# Altium project ConditioningV3.PrjPcb (part 2 of 3)

## Sheet Power_MCU.SchDoc
size 381 x 279 mm; Organization: SACO Technologies; Address1: 7806, Trans-Canada Hwy; Address2: Montreal, QC, Canada - H4S1L3.; Address3: H4S1L3; SheetNumber: 3; SheetTotal: 6; ELE682ProjectName: Conditioning & TLL PCB; ProjectRevision: C; SchDesignedBy1: Alexis Gagnon; SchDesignedBy2: Megane Cyr
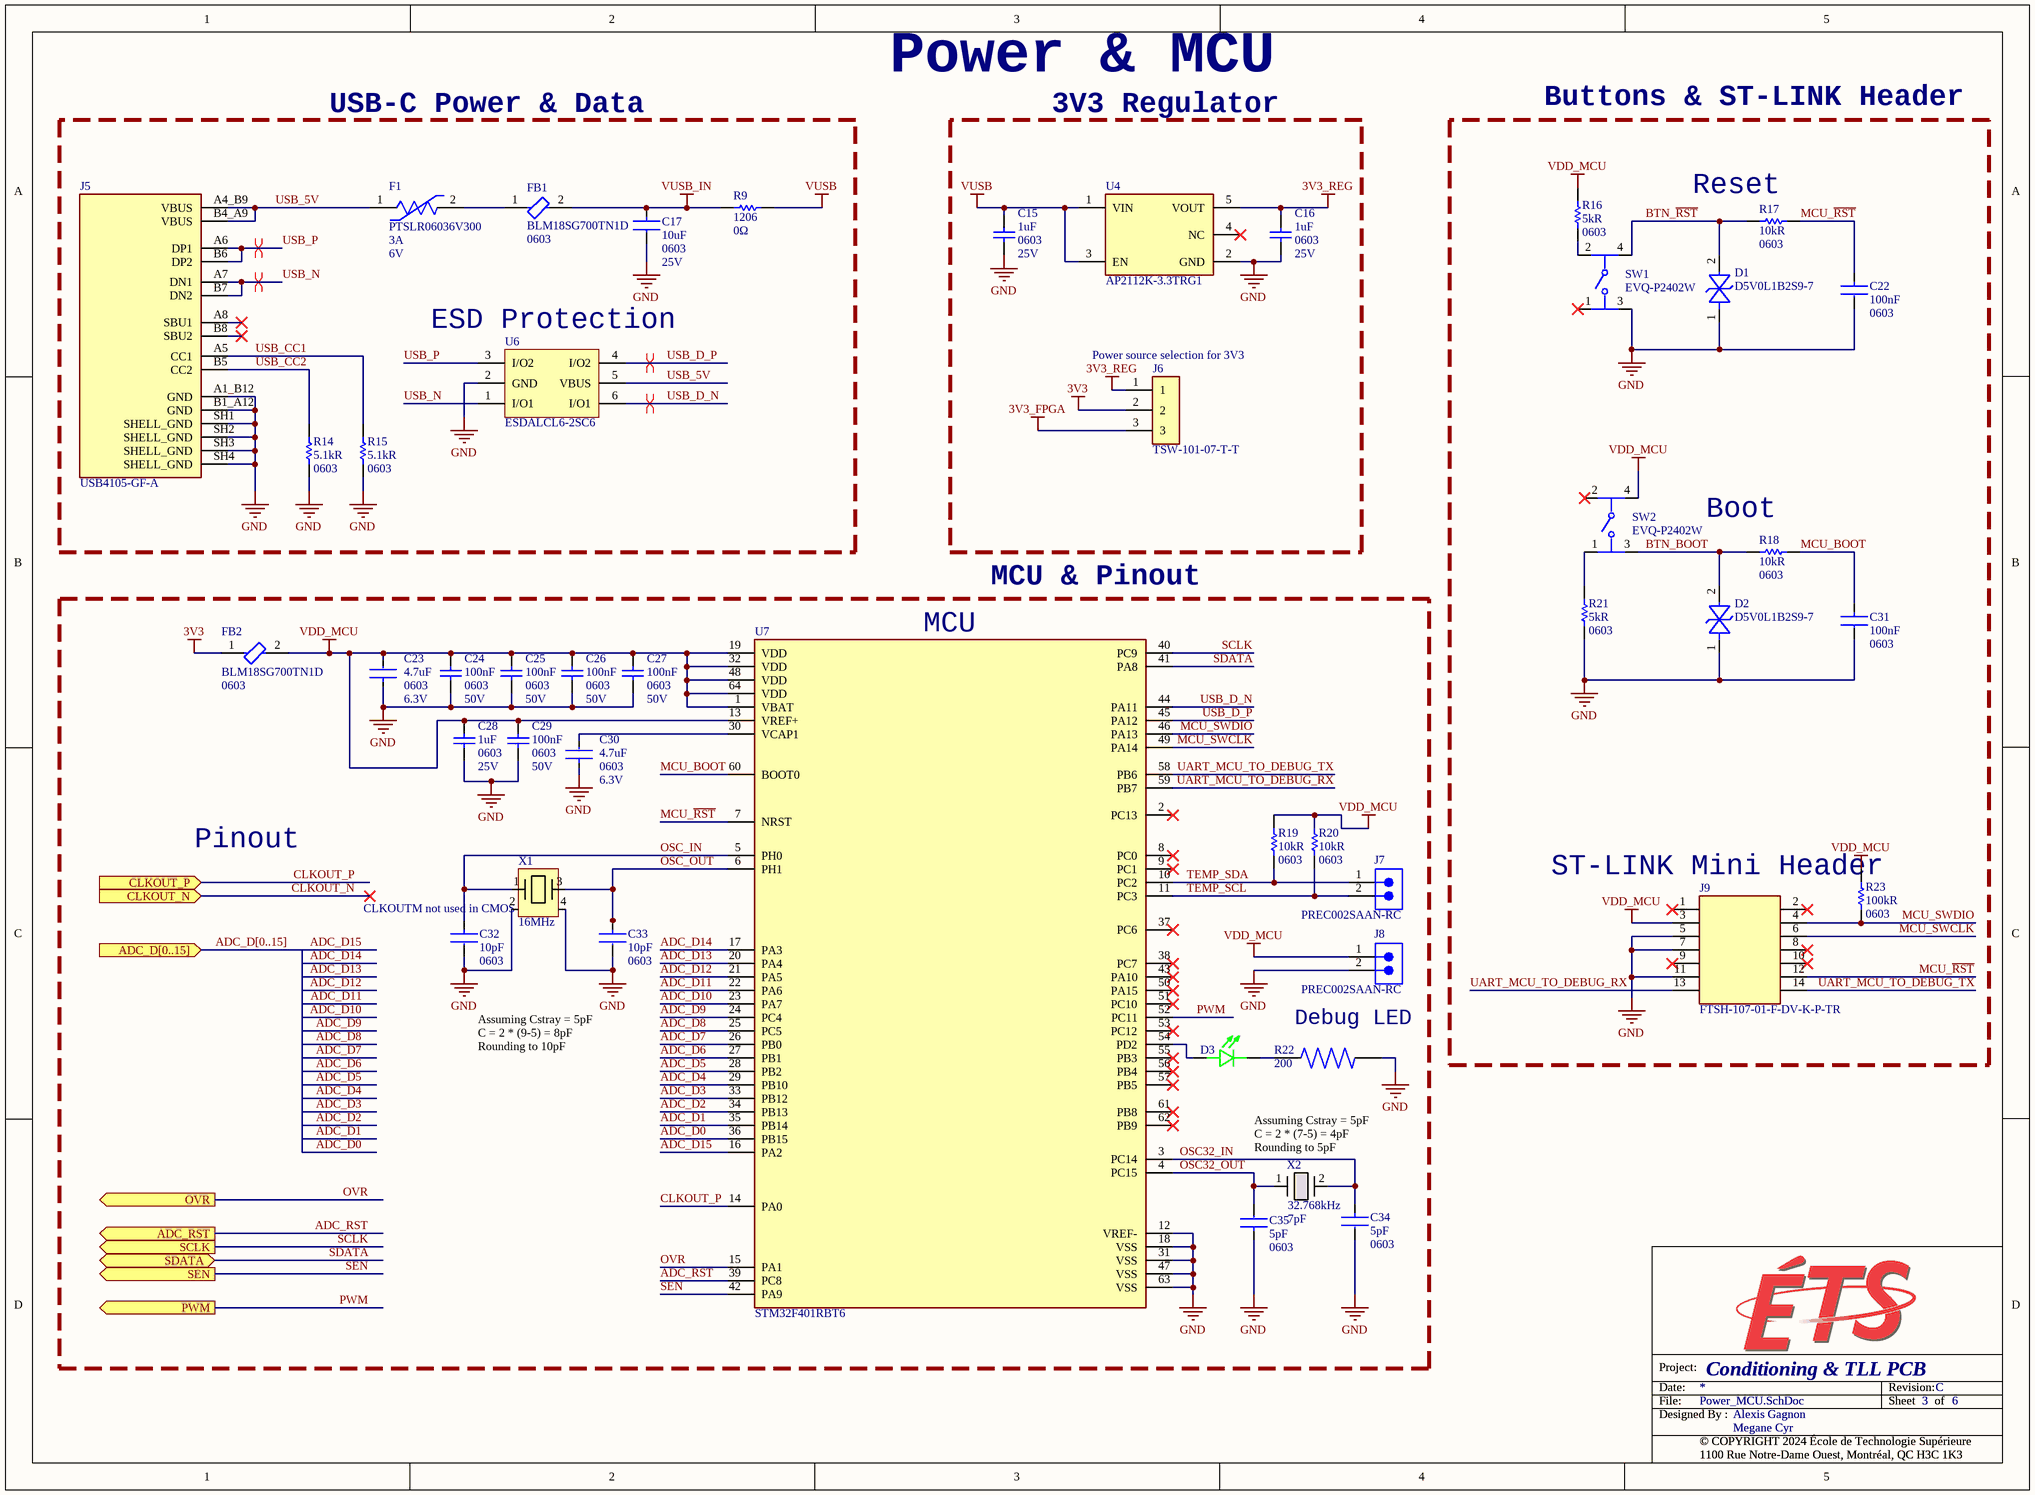
[diagram p4: Power_MCU.SchDoc]

### Parts
C15  value 1uF  Case/Package: 0603  Rated DC Voltage (URdc): 25V  [ANTC1608X90N]  (hidden comment: CL10A105KA8NNNC)
C16  value 1uF  Case/Package: 0603  Rated DC Voltage (URdc): 25V  [ANTC1608X90N]  (hidden comment: CL10A105KA8NNNC)
C17  value 10uF  Case/Package: 0603  Voltage: 25V  [C0603]  (hidden comment: GRM188R61E106MA73D)
C22  value 100nF  Case: 0603  [C0603-V2]  (hidden comment: CL10E104KC8VPNC)
C23  value 4.7uF  Package: 0603  Voltage Rating: 6.3V  [FP-C0603-CG-IPC_B]  (hidden comment: C0603C475K9PACTU)
C24  value 100nF  Case/Package: 0603  Voltage Rating: 50V  [ANTC1608X90N]  (hidden comment: CL10B104KB8NNWC)
C25  value 100nF  Case/Package: 0603  Voltage Rating: 50V  [ANTC1608X90N]  (hidden comment: CL10B104KB8NNWC)
C26  value 100nF  Case/Package: 0603  Voltage Rating: 50V  [ANTC1608X90N]  (hidden comment: CL10B104KB8NNWC)
C27  value 100nF  Case/Package: 0603  Voltage Rating: 50V  [ANTC1608X90N]  (hidden comment: CL10B104KB8NNWC)
C28  value 1uF  Case/Package: 0603  Rated DC Voltage (URdc): 25V  [ANTC1608X90N]  (hidden comment: CL10A105KA8NNNC)
C29  value 100nF  Case/Package: 0603  Voltage Rating: 50V  [ANTC1608X90N]  (hidden comment: CL10B104KB8NNWC)
C30  value 4.7uF  Package: 0603  Voltage Rating: 6.3V  [FP-C0603-CG-IPC_B]  (hidden comment: C0603C475K9PACTU)
C31  value 100nF  Case: 0603  [C0603-V2]  (hidden comment: CL10E104KC8VPNC)
C32  value 10pF  Case/Package: 0603  [C0603-V2]  (hidden comment: GCM1885C2A100JA16D)
C33  value 10pF  Case/Package: 0603  [C0603-V2]  (hidden comment: GCM1885C2A100JA16D)
C34  value 5pF  Case: 0603  [C0603-V2]  (hidden comment: 0603N5R0B101CT)
C35  value 5pF  Case: 0603  [C0603-V2]  (hidden comment: 0603N5R0B101CT)
D1  D5V0L1B2S9-7  [SOD923_DIO]
D2  D5V0L1B2S9-7  [SOD923_DIO]
D3  LTST-C170GKT  [LED_LTST-C170GKT_LTO]  (value not drawn)
F1  PTSLR06036V300  Current Hold: 3A  Voltage: 6V  [FP-PTSLR06036V300-MFG]
FB1  BLM18SG700TN1D  Case Code (Imperial): 0603  [BLM18SG700TN1D-MFG]
FB2  BLM18SG700TN1D  Case Code (Imperial): 0603  [BLM18SG700TN1D-MFG]
J5  USB4105-GF-A  [GCT_USB4105-GF-A]
J6  TSW-101-07-T-T  [SAMTEC_TSW-101-07-T-T]
J7  PREC002SAAN-RC  [CONN_PREC002SAAN-RC_SUL]
J8  PREC002SAAN-RC  [CONN_PREC002SAAN-RC_SUL]
J9  FTSH-107-01-F-DV-K-P-TR  [SAMTEC_FTSH-107-01-F-DV-K-P-TR]
R9  Case/Package: 1206  Resistance: 0Ω  [R1206]  (hidden comment: RC1206JR-070RL)
R14  value 5.1kR  Case/Package: 0603  [R0603]  (hidden comment: RC0603FR-075K1L)
R15  value 5.1kR  Case/Package: 0603  [R0603]  (hidden comment: RC0603FR-075K1L)
R16  value 5kR  Case: 0603  [R0603]  (hidden comment: RT0603BRE075KL)
R17  value 10kR  Case/Package: 0603  [R0603]  (hidden comment: RC0603FR-0710KL)
R18  value 10kR  Case/Package: 0603  [R0603]  (hidden comment: RC0603FR-0710KL)
R19  value 10kR  Case/Package: 0603  [R0603]  (hidden comment: RC0603FR-0710KL)
R20  value 10kR  Case/Package: 0603  [R0603]  (hidden comment: RC0603FR-0710KL)
R21  value 5kR  Case: 0603  [R0603]  (hidden comment: RT0603BRE075KL)
R22  value 200  [RESC1608X55N]  (hidden comment: RC0603JR-07200RL)
R23  value 100kR  Case/Package: 0603  [R0603]  (hidden comment: RC0603FR-07100KL)
SW1  EVQ-P2402W  [FP-EVQ-P2402W-MFG]
SW2  EVQ-P2402W  [FP-EVQ-P2402W-MFG]
U4  AP2112K-3.3TRG1  [FP-SOT25-MFG]
U6  ESDALCL6-2SC6  [ESDALCL6-2SC6]
U7  STM32F401RBT6  [QFP50P1200X1200X160-64N]
X1  value 16MHz  [FP-TSX-3225-MFG]  (hidden comment: TSX-3225 16.0000MF18X-AC0)
X2  value 32.768kHz  Load Capacitance: 7pF  [XTAL_SC32S-7PF20PPM_EPS]  (hidden comment: SC32S-7PF20PPM)

### Blocks framed on the sheet
3V3 Regulator: C15 C16 J6 U4

### Ports
ADC_D[0..15] (in, see TopLevel[3B], Connectors[3A], Heating[5B]), ADC_RST (out, see TopLevel[3B], Heating[5C]), CLKOUT_N (in, see TopLevel[3B], Heating[5B]), CLKOUT_P (in, see TopLevel[3B], Connectors[3B], Heating[5B]), OVR (out, see TopLevel[3B], Heating[5C]), PWM (out, see TopLevel[3B], Connectors[3B], Heating[2B]), SCLK (out, see TopLevel[3B], Heating[5C]), SDATA (bidir, see TopLevel[3B], Heating[5C]), SEN (out, see TopLevel[3B], Heating[5C])

### Nets
3V3: FB2.1 J6.2
3V3_FPGA: J6.3
3V3_REG: C16.2 J6.1 U4.5(VOUT)
GND: C15.1 C16.1 C17.2 C22.2 C23.1 C24.2 C25.2 C26.2 C27.2 C28.1 C29.2 C30.1 C31.2 C32.2 C33.2 C34.2 C35.1 D1.1 D2.1 J5.A1_B12(GND) J5.B1_A12(GND) J5.SH1(SHELL_GND) J5.SH2(SHELL_GND) J5.SH3(SHELL_GND) J5.SH4(SHELL_GND) J8.2 J9.5 J9.7 J9.11 R14.1 R15.1 R21.1 R22.2 SW1.3 U4.2(GND) U6.2(GND) U7.12(VREF-) U7.18(VSS) U7.31(VSS) U7.47(VSS) U7.63(VSS) X1.2 X1.4
VDD_MCU: C23.2 C24.1 C25.1 C26.1 C27.1 C28.2 C29.1 FB2.2 J8.1 J9.3 R16.2 R19.2 R20.2 R23.2 SW2.4 U7.1(VBAT) U7.13(VREF+) U7.19(VDD) U7.32(VDD) U7.48(VDD) U7.64(VDD)
VUSB: C15.2 R9.2 U4.1(VIN) U4.3(EN)
VUSB_IN: C17.1 FB1.2 R9.1
ADC_D0: U7.36(PB15)
ADC_D1: U7.35(PB14)
ADC_D2: U7.34(PB13)
ADC_D3: U7.33(PB12)
ADC_D4: U7.29(PB10)
ADC_D5: U7.28(PB2)
ADC_D6: U7.27(PB1)
ADC_D7: U7.26(PB0)
ADC_D8: U7.25(PC5)
ADC_D9: U7.24(PC4)
ADC_D10: U7.23(PA7)
ADC_D11: U7.22(PA6)
ADC_D12: U7.21(PA5)
ADC_D13: U7.20(PA4)
ADC_D14: U7.17(PA3)
ADC_D15: U7.16(PA2)
ADC_RST: U7.39(PC8) ; port ADC_RST
BTN_BOOT: D2.2 R18.1 SW2.3
BTN_~{RST}: D1.2 R17.1 SW1.4
CLKOUT_P: U7.14(PA0) ; port CLKOUT_P
MCU_BOOT: C31.1 R18.2 U7.60(BOOT0)
MCU_~{RST}: C22.1 J9.12 R17.2 U7.7(NRST)
MCU_SWCLK: J9.6 U7.49(PA14)
MCU_SWDIO: J9.4 R23.1 U7.46(PA13)
OSC32_IN: C34.1 U7.3(PC14) X2.2
OSC32_OUT: C35.2 U7.4(PC15) X2.1
OSC_IN: C32.1 U7.5(PH0) X1.1
OSC_OUT: C33.1 U7.6(PH1) X1.3
OVR: U7.15(PA1) ; port OVR
PWM: U7.52(PC11) ; port PWM
SCLK: U7.40(PC9) ; port SCLK
SDATA: U7.41(PA8) ; port SDATA
SEN: U7.42(PA9) ; port SEN
TEMP_SCL: J7.2 R20.1 U7.11(PC3)
TEMP_SDA: J7.1 R19.1 U7.10(PC2)
UART_MCU_TO_DEBUG_RX: J9.13 U7.59(PB7)
UART_MCU_TO_DEBUG_TX: J9.14 U7.58(PB6)
USB_5V: F1.1 J5.A4_B9(VBUS) J5.B4_A9(VBUS) U6.5(VBUS)
USB_CC1: J5.A5(CC1) R15.2
USB_CC2: J5.B5(CC2) R14.2
USB_D_N: U6.6(I/O1) U7.44(PA11)
USB_D_P: U6.4(I/O2) U7.45(PA12)
USB_N: J5.A7(DN1) J5.B7(DN2) U6.1(I/O1)
USB_P: J5.A6(DP1) J5.B6(DP2) U6.3(I/O2)
NetC30_2: C30.2 U7.30(VCAP1)
NetD3_1: D3.1 R22.1
NetD3_2: D3.2 U7.54(PD2)
NetF1_2: F1.2 FB1.1
NetR16_1: R16.1 SW1.2
NetR21_2: R21.2 SW2.1

Not connected (* = marked no-connect by the designer): J5 A8(SBU1)* B8(SBU2)*; J9 1* 2* 8* 9* 10*; SW1 1*; SW2 2*; U4 4(NC)*; U7 2(PC13)* 8(PC0)* 9(PC1)* 37(PC6)* 38(PC7)* 43(PA10)* 50(PA15)* 51(PC10)* 53(PC12)* 55(PB3)* 56(PB4)* 57(PB5)* 61(PB8)* 62(PB9)*

### Buses and harness runs
bus ADC_D[0..15] = port ADC_D[0..15]

### Layout directives
differential pair: USB_D_N, USB_D_P, USB_N, USB_P

### Notes on the sheet
- Power & MCU
- USB-C Power & Data
- Buttons & ST-LINK Header
- (near R17) Reset
- (near U6) ESD Protection
- (near J6) Power source selection for 3V3
- (near R18) Boot
- (near U7) MCU
- MCU & Pinout
- Pinout
- ST-LINK Mini Header
- CLKOUTM not used in CMOS
- Debug LED
- Assuming Cstray = 5pF
  C = 2 * (9-5) = 8pF
  Rounding to 10pF
- (near X2) Assuming Cstray = 5pF
  C = 2 * (7-5) = 4pF
  Rounding to 5pF
- Project:
- File:
- Date:
- Designed By :
- © COPYRIGHT 2024 École de Technologie Supérieure
- Revision:
- Sheet
- of
- 1100 Rue Notre-Dame Ouest, Montréal, QC H3C 1K3

### Library data of the parts
C15 C16 C28 = CL10A105KA8NNNC: CAP CER 1UF 25V X5R 0603; Manufacturer: Samsung; Dielectric Material: Ceramic; Multilayer: Yes; Tolerance  (fill in as +-): 10%; Supplier: Arrow Electronics; Supplier Part Number: CL10A105KA8NNNC; Manufacturer Part Number: CL10A105KA8NNNC; RoHS: Yes; Category: Ceramic Capacitors; Stock: 444000; Pricing: 4000=0.0054, 8000=0.0044, 28000=0.0037, 100000=0.0034, 200000=0.0032 (USD); Mounting Technology: Surface Mount; Pins: 2; Package Shape: Rectangular; Terminal Finish: Nickel; Min Operating Temperature: -55°C; Max Operating Temperature: 85°C; JESD-609 Code: e3; Capacitor Type: Ceramic; Package Style: SMTMeter; Packaging: Tape and Reel; Tolerance (fill in as +-): 10%; Temperature Characteristics Code: X5R; Termination: Wraparound; Length: 1.6mm; Width: 0.8mm; Height: 0.9mm; Reach SVHC Compliant: Yes; RoHS Compliant: Yes; ComponentLink1URL: https://datasheet.ciiva.com:443/pdfs/VipMasterIC/IC/SEMS/SEMS-S-A0008520814/SEMS-S-A0008520762-1.pdf?src-supplier=IHS+Markit; ComponentLink1Description: https://datasheet.ciiva.com:443/pdfs/VipMasterIC/IC/SEMS/SEMS-S-A0008520814/SEMS-S-A0008520762-1.pdf?src-supplier=IHS+Markit; ComponentLink2URL: https://datasheet.ciiva.com/25801/cl10a105ka8nnnc-25801364.pdf?src-supplier=Digikey; ComponentLink2Description: https://datasheet.ciiva.com/25801/cl10a105ka8nnnc-25801364.pdf?src-supplier=Digikey; ComponentLink3URL: https://datasheet.ciiva.com/26838/getdatasheetpartid-357530-26838332.pdf?src-supplier=Verical; ComponentLink3Description: https://datasheet.ciiva.com/26838/getdatasheetpartid-357530-26838332.pdf?src-supplier=Verical; ComponentLink4URL: https://datasheet.ciiva.com/29198/458162-da-01-en-vs-kondensator-0603-29198475.pdf?src-supplier=Conrad; ComponentLink4Description: https://datasheet.ciiva.com/29198/458162-da-01-en-vs-kondensator-0603-29198475.pdf?src-supplier=Conrad
C17 = GRM188R61E106MA73D: CAP CER 10UF 25V X5R 0603; Manufacturer: Murata; Tolerance: 20%; Dielectric Material: Ceramic; Multilayer: Yes; Resistor Type: Ceramic; Max Operating Temperature: 85°C; Min Operating Temperature: -55°C; Capacitance: 10uF; Dielectric: X5R; Lead Free: Lead Free; REACH SVHC: No SVHC; Mount: Surface Mount; Voltage Rating (DC): 25V; Height: 0.8mm; Length: 1.6mm; Thickness: 0.031inch; Width: 0.031inch; Termination: SMD/SMT; Case Code (Imperial): 0603; Case Code (Metric): 1608; Package Quantity: 1; Packaging: Tape and Reel; Depth: 0.8mm; Voltage Rating: 25V; Weight: 0.000222oz; Number of Pins: 2; Supplier: Mouser; Supplier Part Number: 81-GRM188R61E106MA3D; Manufacturer Part Number: GRM188R61E106MA73D; RoHS: Yes; Category: Ceramic Capacitors; Stock: 623980; Pricing: 1=0.18, 10=0.054, 50=0.054, 100=0.046, 1000=0.044, 4000=0.04, 10000=0.04 (USD); Mounting Technology: Surface Mount; Pins: 2; Package Shape: Rectangular; Terminal Finish: Nickel; JESD-609 Code: e3; Capacitor Type: Ceramic; Tolerance  (fill in as +-): 20%; Package Style: SMTMeter; Tolerance (fill in as +-): 20%; Rated DC Voltage (URdc): 25V; Temperature Characteristics Code: X5R; Reach SVHC Compliant: Yes; RoHS Compliant: Yes; ComponentLink1URL: https://psearch.en.murata.com:443/capacitor/product/GRM188R61E106MA73%23.pdf?src-supplier=IHS+Markit; ComponentLink1Description: https://psearch.en.murata.com:443/capacitor/product/GRM188R61E106MA73%23.pdf?src-supplier=IHS+Markit; ComponentLink2URL: https://datasheet.ciiva.com/14906/partnumbering-e-01-14906429.pdf?src-supplier=Digikey; ComponentLink2Description: https://datasheet.ciiva.com/14906/partnumbering-e-01-14906429.pdf?src-supplier=Digikey; ComponentLink3URL: https://datasheet.ciiva.com/14906/partnumbering-e-01-14906431.pdf?src-supplier=Digikey; ComponentLink3Description: https://datasheet.ciiva.com/14906/partnumbering-e-01-14906431.pdf?src-supplier=Digikey; ComponentLink4URL: https://datasheet.ciiva.com/22776/608985-22776426.pdf?src-supplier=Farnell; ComponentLink4Description: https://datasheet.ciiva.com/22776/608985-22776426.pdf?src-supplier=Farnell; ComponentLink5URL: https://datasheet.ciiva.com/22776/c02e-22776427.pdf?src-supplier=Farnell; ComponentLink5Description: https://datasheet.ciiva.com/22776/c02e-22776427.pdf?src-supplier=Farnell; ComponentLink6URL: https://datasheet.ciiva.com/22619/c02e-22619674.pdf?src-supplier=Element14; ComponentLink6Description: https://datasheet.ciiva.com/22619/c02e-22619674.pdf?src-supplier=Element14
C22 C31 = CL10E104KC8VPNC: CAP CER 100NF 100V X8L 0603; Manufacturer: Samsung; Supplier: Digikey; Supplier Part Number: 1276-CL10E104KC8VPNCCT-ND; Manufacturer Part Number: CL10E104KC8VPNC; RoHS: No; Stock: 47712; Pricing: 1=0.27, 10=0.155, 50=0.1104, 100=0.0966, 500=0.07306, 1000=0.06573 (USD)
C23 C30 = CMP-2006-02256-2: CAP CER 4.7UF 6.3V X5R 0603; Manufacturer: Kemet; Temperature Coefficient: 15%; Tolerance: 10%; Material: Ceramic; Device Class L3: Ceramic Capacitors; RoHS: TRUE; Lead Free: Yes; ComponentLink2Description: Datasheet; Mouser Description: Multilayer Ceramic Capacitors MLCC - SMD/SMT 6.3volts 4.7uF X5R 10%; Digikey Description: CAP CER 4.7UF 6.3V X5R 0603; ComponentLink2URL: https://content.kemet.com/datasheets/KEM_C1006_X5R_SMD.pdf; Category: Cap; Temperature Range Low: -55°C; Capacitance: 4.7uF; Temperature: -55°C to +85°C; Octopart: https://octopart.com/c0603c475k9pactu-kemet-104242; Ipc Land Pattern Name: CAPC16080X80; Temperature Range High: +85°C; Height: 0.9mm; Temperature Characteristic: X5R; Device Class L1: Passive Components; Manufacturer Part Number: C0603C475K9PACTU; Automotive: No; Device Class L2: Capacitors
C24-C27 C29 = CL10B104KB8NNWC: CAP CER 0.1UF 50V X7R 0603; Manufacturer: Samsung; Tolerance: 10%; Supplier: Arrow Electronics; Supplier Part Number: CL10B104KB8NNWC; Manufacturer Part Number: CL10B104KB8NNWC; RoHS: Yes; Category: Ceramic Capacitors; Stock: 4312000; Pricing: 4000=0.0024 (USD); Mounting Technology: Surface Mount; Case Code (Metric): 1608; Case Code (Imperial): 0603; Min Operating Temperature: -55°C; Max Operating Temperature: 125°C; Package Quantity: 1; Packaging: Cut Tape; Series: CL; Length: 0.063inch; Width: 0.031inch; Thickness: 0.035inch; RoHS Compliant: Yes; ComponentLink1URL: https://datasheet.ciiva.com/25740/cl10b104kb8nnwc-25740227.pdf?src-supplier=Digikey; ComponentLink1Description: https://datasheet.ciiva.com/25740/cl10b104kb8nnwc-25740227.pdf?src-supplier=Digikey
C32 C33 = GCM1885C2A100JA16D: CAP CER 10PF 100V C0G/NP0 0603; Manufacturer: Murata; Dielectric Material: Ceramic; Multilayer: Yes; Tolerance  (fill in as +-): 5%; Temperature Characteristics Code: C0G; Reference Standard: AEC-Q200; Supplier: Mouser; Supplier Part Number: 81-GCM1885C2A100JA6D; Manufacturer Part Number: GCM1885C2A100JA16D; RoHS: Yes; Category: Ceramic Capacitors; Stock: 25975; Pricing: 1=0.1, 10=0.028, 50=0.028, 100=0.019, 1000=0.017, 10000=0.011 (USD); Mounting Technology: Surface Mount; Pins: 2; Package Shape: Rectangular; Terminal Finish: Nickel; Min Operating Temperature: -55°C; Max Operating Temperature: 125°C; JESD-609 Code: e3; Capacitor Type: Ceramic; Package Style: SMTMeter; Packaging: Tape and Reel; Tolerance (fill in as +-): 5%; Rated DC Voltage (URdc): 100V; Termination: Wraparound; Length: 1.6mm; Width: 0.8mm; Height: 0.9mm; Reach SVHC Compliant: Yes; RoHS Compliant: Yes; ComponentLink1URL: https://datasheet.ciiva.com:443/pdfs/VipMasterIC/IC/MURE/MURE-S-A0004365318/MURE-S-A0004370306-1.pdf?src-supplier=IHS+Markit; ComponentLink1Description: https://datasheet.ciiva.com:443/pdfs/VipMasterIC/IC/MURE/MURE-S-A0004365318/MURE-S-A0004370306-1.pdf?src-supplier=IHS+Markit; ComponentLink2URL: https://datasheet.ciiva.com/133/product-133480.pdf?src-supplier=Digikey; ComponentLink2Description: https://datasheet.ciiva.com/133/product-133480.pdf?src-supplier=Digikey; ComponentLink3URL: https://datasheet.ciiva.com/133/product-133481.pdf?src-supplier=Digikey; ComponentLink3Description: https://datasheet.ciiva.com/133/product-133481.pdf?src-supplier=Digikey; ComponentLink4URL: https://datasheet.ciiva.com/133/product-133482.pdf?src-supplier=Digikey; ComponentLink4Description: https://datasheet.ciiva.com/133/product-133482.pdf?src-supplier=Digikey; ComponentLink5URL: https://datasheet.ciiva.com/18183/getdatasheetpartid-307287-18183583.pdf?src-supplier=Verical; ComponentLink5Description: https://datasheet.ciiva.com/18183/getdatasheetpartid-307287-18183583.pdf?src-supplier=Verical; ComponentLink6URL: https://datasheet.ciiva.com/11607/product-11607353.pdf?src-supplier=Avnet; ComponentLink6Description: https://datasheet.ciiva.com/11607/product-11607353.pdf?src-supplier=Avnet
C34 C35 = 0603N5R0B101CT: CAP CER 5PF 100V C0G/NP0 0603; Manufacturer: Walsin Technologies; Supplier: Digikey; Supplier Part Number: 1292-1649-1-ND; Manufacturer Part Number: 0603N5R0B101CT; RoHS: Yes; Category: Ceramic Capacitors; Stock: 11864; Pricing: 1=0.1, 10=0.067, 50=0.0402, 100=0.0316, 500=0.02332, 1000=0.01931 (USD); ComponentLink1URL: http://www.passivecomponent.com/wp-content/uploads/2018/10/MLCC.pdf?src-supplier=Digikey; ComponentLink1Description: http://www.passivecomponent.com/wp-content/uploads/2018/10/MLCC.pdf?src-supplier=Digikey
D1 D2 = D5V0L1B2S9-7: TVS DIODE 5VWM 14VC SOD923; Mfr_Name: Diodes Inc; Manufacturer: Diodes; Diode Element Material: SILICON; Package Body Material: Plastic; Polarity: Bidirectional; Max Breakdown Voltage: 8V; Min Breakdown Voltage: 6V; Diode Type: TRANS VOLTAGE SUPPRESSOR; Non-rep Peak Rev Power Dis-Max: 84W; Number of Elements: 1; Max Power Dissipation: 250mW; Rep Pk Reverse Voltage-Max: 5V; Supplier: Digikey; Supplier Part Number: D5V0L1B2S9-7DICT-ND; Manufacturer Part Number: D5V0L1B2S9-7; RoHS: Yes; Category: TVS Diodes; Stock: 757815; Pricing: 1=0.16, 10=0.109, 100=0.048, 500=0.043, 1000=0.038, 2000=0.037, 5000=0.036 (USD); Pins: 2; Package Shape: Rectangular; Terminal Finish: Tin; Min Operating Temperature: -65°C; Max Operating Temperature: 150°C; JESD-609 Code: e3; JESD-30 Code: R-PDSO-F2; Moisture Sensitivity Level: 1; Package Style: SMALL OUTLINEMeter; Surface Mount: Yes; Technology: AVALANCHE; Terminal Form: Flat; Terminal Position: DUAL; Reach SVHC Compliant: Yes; RoHS Compliant: Yes; ComponentLink1URL: https://datasheet.ciiva.com:443/pdfs/VipMasterIC/IC/DIOD/DIOD-S-A0001248739/DIOD-S-A0001248739-1.pdf?src-supplier=IHS+Markit; ComponentLink1Description: https://datasheet.ciiva.com:443/pdfs/VipMasterIC/IC/DIOD/DIOD-S-A0001248739/DIOD-S-A0001248739-1.pdf?src-supplier=IHS+Markit; ComponentLink2URL: https://datasheet.ciiva.com/48480/d5v0l1b2s9-48480055.pdf?src-supplier=Avnet; ComponentLink2Description: https://datasheet.ciiva.com/48480/d5v0l1b2s9-48480055.pdf?src-supplier=Avnet
D3 = LTST-C170GKT: LED GREEN CLEAR SMD; Manufacturer_Name: LITE-ON; Copyright: Copyright (C) 2025 Ultra Librarian. All rights reserved.; Manufacturer_Part_Number: LTST-C170GKT
F1 = PTSLR06036V300: PTC RESET FUSE 3A 6V 0603; Manufacturer: Eaton; Supplier: Digikey; Supplier Part Number: 283-PTSLR06036V300CT-ND; Manufacturer Part Number: PTSLR06036V300; RoHS: No; Category: PTC Resettable Fuses; Stock: 24503; Pricing: 1=0.35, 5=0.29, 10=0.268, 50=0.223, 100=0.2062, 250=0.1858, 500=0.17166, 1000=0.16168 (USD); ComponentLink1URL: https://datasheet.octopart.com/PTSLR06036V300-Eaton-datasheet-158170729.pdf?src-supplier=Sager+Electronics; ComponentLink1Description: https://datasheet.octopart.com/PTSLR06036V300-Eaton-datasheet-158170729.pdf?src-supplier=Sager+Electronics
FB1 FB2 = BLM18SG700TN1D: FERRITE BEAD 70 OHM 0603 1LN; Manufacturer: Murata; Max DC Current: 4A; Tolerance: 25%; DC Resistance (DCR): 20mR; Material: Steel; Test Frequency: 100MHz; Number of Circuits: 1; Impedance: 70R; Filter Type: FERRITE CHIP; Lead Free: Lead Free; Min Operating Temperature: -55°C; Width: 0.8mm; Case Code (Metric): 1608; RoHS Compliant: Yes; Core Material: Ferrite; Max Operating Temperature: 125°C; Number of Pins: 2; Current Rating: 4A; Series: BLM18S; Depth: 0.8mm; Packaging: Tape and Reel; Height: 0.8mm; Number of Lines: 1; Case/Package: 0603; Package Quantity: 1; Termination: SMD/SMT; REACH SVHC: No SVHC; Max Current Rating: 4A; DC Resistance-Max: 20mR; Length: 1.6mm; Supplier: Mouser; Supplier Part Number: 81-BLM18SG700TN1D; Manufacturer Part Number: BLM18SG700TN1D; RoHS: Yes; Category: Ferrite Beads and Chips; Stock: 139676; Pricing: 1=0.14, 10=0.071, 50=0.071, 100=0.049, 1000=0.041, 10000=0.03 (USD); Mounting Technology: Surface Mount; Case Code: 0603; Terminal Finish: Tin; JESD-609 Code: e3; Construction: Chip Bead; Clock Frequency: 100MHz; Min Frequency: 100MHz; Channels: 1; Output Impedance: 70R; Reach SVHC Compliant: Yes; ComponentLink1URL: https://datasheet.ciiva.com:443/pdfs/VipMasterIC/IC/MURE/MURE-S-A0008515766/MURE-S-A0008515869-1.pdf?src-supplier=IHS+Markit; ComponentLink1Description: https://datasheet.ciiva.com:443/pdfs/VipMasterIC/IC/MURE/MURE-S-A0008515766/MURE-S-A0008515869-1.pdf?src-supplier=IHS+Markit; ComponentLink2URL: https://datasheet.ciiva.com/8021/5151-8021529.pdf?src-supplier=Element14; ComponentLink2Description: https://datasheet.ciiva.com/8021/5151-8021529.pdf?src-supplier=Element14; ComponentLink3URL: https://datasheet.ciiva.com/8021/5151-8021530.pdf?src-supplier=Element14; ComponentLink3Description: https://datasheet.ciiva.com/8021/5151-8021530.pdf?src-supplier=Element14; ComponentLink4URL: https://datasheet.ciiva.com/14122/blm-series-eng-tds-14122901.pdf?src-supplier=Distrelec; ComponentLink4Description: https://datasheet.ciiva.com/14122/blm-series-eng-tds-14122901.pdf?src-supplier=Distrelec; ComponentLink5URL: https://datasheet.ciiva.com/6212/l0110s0100blm18s-6212357.pdf?src-supplier=Digikey; ComponentLink5Description: https://datasheet.ciiva.com/6212/l0110s0100blm18s-6212357.pdf?src-supplier=Digikey; ComponentLink6URL: https://datasheet.ciiva.com/6212/l0110s0100blm18s-6212359.pdf?src-supplier=Digikey; ComponentLink6Description: https://datasheet.ciiva.com/6212/l0110s0100blm18s-6212359.pdf?src-supplier=Digikey; ComponentLink7URL: https://datasheet.ciiva.com/16420/l0110s0100blm18s-16420729.pdf?src-supplier=Future+Electronics; ComponentLink7Description: https://datasheet.ciiva.com/16420/l0110s0100blm18s-16420729.pdf?src-supplier=Future+Electronics
J5 = USB4105-GF-A: CONN RCP USB2.0 TYP C 24P SMD RA; Manufacturer: Global Connector Technology; Supplier: Newark; Supplier Part Number: 71AJ9393; Manufacturer Part Number: USB4105-GF-A; RoHS: No; Category: USB Connectors; ComponentLink1URL: https://gct.co/files/drawings/usb4105.pdf?src-supplier=Digikey; ComponentLink1Description: https://gct.co/files/drawings/usb4105.pdf?src-supplier=Digikey
J6 = TSW-101-07-T-T: MF: Samtec; Package: None; Value: *; Availability: Unavailable; MP: TSW-101-07-T-T; Price: None
J7 J8 = PREC002SAAN-RC: CONN HEADER .100 SNGL STR 2POS; Manufacturer: Sullins; Number of Positions: 2; Pitch: 0.1inch; Supplier: Digikey; Supplier Part Number: S1012EC-02-ND; Manufacturer Part Number: PREC002SAAN-RC; RoHS: Yes; Category: Connectors; Stock: 28469; Pricing: 1=0.1, 10=0.039, 100=0.0287, 500=0.02378, 1000=0.02081, 5000=0.01784, 10000=0.01734 (USD); Mounting Technology: Through Hole; Color: Black; Contact Plating: Tin; Package Quantity: 1; Number of Rows: 1; Packaging: Bulk; Termination: Solder; Series: -; Contact Type: Male Pin; Contact Mating Length: 0.23inch; RoHS Compliant: Yes; ComponentLink1URL: https://datasheet.ciiva.com/740/zrzczzzszzn-rc-st-11635-b-740843.pdf?src-supplier=Digikey; ComponentLink1Description: https://datasheet.ciiva.com/740/zrzczzzszzn-rc-st-11635-b-740843.pdf?src-supplier=Digikey
J9 = FTSH-107-01-F-DV-K-P-TR: CONN HEADER SMD 14POS 1.27MM; Manufacturer: Samtec; Connector Type: BOARD CONNECTOR; Contact Pattern: RECTANGULAR; Contact Style: SQ PIN-SKT; Number Of Connectors: 1; Number Of PCB Rows: 2; Number of Contacts: 14; Body Breadth: 0.135inch; Body Length: 0.35inch; Mating Contact Pitch: 0.05inch; Mounting Option 1: LOCKING; PCB Contact Row Spacing: 4.064mm; Plating Thickness: 3uin; Reference Standard: UL; Reliability: COMMERCIAL; Supplier: Avnet; Supplier Part Number: FTSH-107-01-F-DV-K-P-TR; Manufacturer Part Number: FTSH-107-01-F-DV-K-P-TR; RoHS: Yes; Category: Headers and Wire Housings; Stock: 1872; Pricing: 400=2.37529, 800=2.0349, 1600=1.7286, 2400=1.6884, 3200=1.4396 (USD); Mounting Technology: Board; Contact Material: Bronze; Contact Finish - Mating: AU ON NI; Contact Finish - Termination: Tin (Sn) - with Nickel (Ni) barrier; Insulation Material: Polymer; JESD-609 Code: e3; Contact Gender: Male; Mounting Style: STRAIGHT; Number of Rows Loaded: 2; PCB Contact Pattern: RECTANGULAR; Termination: SMD/SMT; Mating Contact Row Spacing: 0.05inch; Terminal Pitch: 1.27mm; Reach SVHC Compliant: Yes; RoHS Compliant: Yes; ComponentLink1URL: https://datasheet.ciiva.com:443/pdfs/VipMasterIC/IC/SAMI/SAMI-S-A0002896813/SAMI-S-A0002896813-1.pdf?src-supplier=IHS+Markit; ComponentLink1Description: https://datasheet.ciiva.com:443/pdfs/VipMasterIC/IC/SAMI/SAMI-S-A0002896813/SAMI-S-A0002896813-1.pdf?src-supplier=IHS+Markit; ComponentLink2URL: https://datasheet.ciiva.com/10037/ftsh-mt-10037030.pdf?src-supplier=Avnet; ComponentLink2Description: https://datasheet.ciiva.com/10037/ftsh-mt-10037030.pdf?src-supplier=Avnet
R9 = RC1206JR-070RL: RES 0 OHM JUMPER 1/4W 1206; Manufacturer: YAGEO; Voltage Rating: 200V; Temperature Coefficient: 300ppm/°C; Power Rating: 0.25W; Value: 0Ω; Tolerance: 5%; Power: 250mW; Rated Temperature: 70°C; Package Height: 0.55mm; Package Length: 3.1mm; Package Width: 1.6mm; Manufacturer Part Number: RC1206JR-070RL; Temperature Range Low: -55°C; Category: Res; Automotive: No; Ipc Land Pattern Name: RESC310160X55; Device Class L1: Passive Components; Temperature: -55°C to +155°C; ComponentLink2URL: https://www.yageo.com/upload/media/product/productsearch/datasheet/rchip/PYu-RC_Group_51_RoHS_L_10.pdf; Lead Free: Yes; Height: 0.65mm; Footprint Url: https://www.yageo.com/upload/website/yageo_PYu-R_Mount_10_19050818_343.pdf; Package: RC1206; Digikey Description: RES SMD 0 OHM JUMPER 1/4W 1206; Temperature Range High: +155°C; Device Class L3: Chip SMD Resistors; Device Class L2: Resistors; Octopart: https://octopart.com/rc1206jr-070rl-yageo-40025601; Series: RC; ComponentLink2Description: Datasheet; Composition: Thick Film; RoHS: TRUE; Mouser Description: Resistor: thick film; SMD; 1206; 0O; 0.25W; ±5%; -55÷155°C; Supplier: Future Electronics; Supplier Part Number: 1414689; Stock: 40265000; Pricing: 5000=0.0038, 15000=0.0036, 25000=0.0036, 75000=0.0034, 125000=0.0033 (USD); Mounting Technology: Surface Mount; Pins: 2; Package Shape: Rectangular; Terminal Finish: Nickel; Min Operating Temperature: -55°C; Max Operating Temperature: 155°C; JESD-609 Code: e3; Resistor Type: FIXED RESISTOR; Construction: Chip; Packaging: Tape and Reel; Technology: METAL GLAZE/THICK FILM; Termination: Wraparound; Reach SVHC Compliant: Yes; RoHS Compliant: Yes; ComponentLink1URL: https://datasheet.ciiva.com:443/pdfs/VipMasterIC/IC/YAGO/YAGO-S-A0008145938/YAGO-S-A0008145938-1.pdf?src-supplier=IHS+Markit; ComponentLink1Description: https://datasheet.ciiva.com:443/pdfs/VipMasterIC/IC/YAGO/YAGO-S-A0008145938/YAGO-S-A0008145938-1.pdf?src-supplier=IHS+Markit; ComponentLink3URL: https://datasheet.ciiva.com/11808/0900766b80c6630a-11808156.pdf?src-supplier=Rs; ComponentLink3Description: https://datasheet.ciiva.com/11808/0900766b80c6630a-11808156.pdf?src-supplier=Rs; ComponentLink4URL: https://datasheet.ciiva.com/7857/1692832-7857421.pdf?src-supplier=Element14; ComponentLink4Description: https://datasheet.ciiva.com/7857/1692832-7857421.pdf?src-supplier=Element14; ComponentLink5URL: https://datasheet.ciiva.com/7857/1692832-7857422.pdf?src-supplier=Element14; ComponentLink5Description: https://datasheet.ciiva.com/7857/1692832-7857422.pdf?src-supplier=Element14; ComponentLink6URL: https://datasheet.ciiva.com/46445/444357-46445719.pdf?src-supplier=Element14; ComponentLink6Description: https://datasheet.ciiva.com/46445/444357-46445719.pdf?src-supplier=Element14; ComponentLink7URL: https://datasheet.ciiva.com/22747/1692832-22747541.pdf?src-supplier=Element14; ComponentLink7Description: https://datasheet.ciiva.com/22747/1692832-22747541.pdf?src-supplier=Element14; ComponentLink8URL: https://datasheet.ciiva.com/2458/pyu-rc1206-51-rohs-l-4-2458668.pdf?src-supplier=Digikey; ComponentLink8Description: https://datasheet.ciiva.com/2458/pyu-rc1206-51-rohs-l-4-2458668.pdf?src-supplier=Digikey; ComponentLink9URL: https://datasheet.ciiva.com/2458/pyu-rc1206-51-rohs-l-4-2458669.pdf?src-supplier=Digikey; ComponentLink9Description: https://datasheet.ciiva.com/2458/pyu-rc1206-51-rohs-l-4-2458669.pdf?src-supplier=Digikey; ComponentLink10URL: https://datasheet.ciiva.com/2458/pyu-rc1206-51-rohs-l-4-2458670.pdf?src-supplier=Digikey; ComponentLink10Description: https://datasheet.ciiva.com/2458/pyu-rc1206-51-rohs-l-4-2458670.pdf?src-supplier=Digikey; ComponentLink11URL: https://datasheet.ciiva.com/17035/pyu-rc1206-51-rohs-l-4-17035512.pdf?src-supplier=Future+Electronics; ComponentLink11Description: https://datasheet.ciiva.com/17035/pyu-rc1206-51-rohs-l-4-17035512.pdf?src-supplier=Future+Electronics
R14 R15 = RC0603FR-075K1L: RES 5.1K OHM 1% 1/10W 0603; Manufacturer: Yageo; Additional Feature: LASER TRIMMABLE; Power: 100mW; Rated Temperature: 70°C; Working Voltage: 75V; Temperature Coefficient (ppm/Cel): 100; Package Height: 0.45mm; Package Length: 1.6mm; Package Width: 0.8mm; Part Number: RC0603FR-075K1L; Supplier: Future Electronics; Supplier Part Number: 4500864; Manufacturer Part Number: RC0603FR-075K1L; RoHS: Yes; Category: Chip SMD Resistors; Stock: 2250000; Pricing: 5000=0.0011, 25000=0.0011, 125000=0.001, 250000=0.001, 750000=0.001 (USD); Mounting Technology: Surface Mount; Pins: 2; Package Shape: Rectangular; Terminal Finish: Nickel; Min Operating Temperature: -55°C; Max Operating Temperature: 155°C; Tolerance: 1%; JESD-609 Code: e3; Resistor Type: FIXED RESISTOR; Construction: Chip; Packaging: Tape and Reel; Technology: METAL GLAZE/THICK FILM; Termination: Wraparound; Reach SVHC Compliant: Yes; RoHS Compliant: Yes; ComponentLink1URL: https://datasheet.ciiva.com:443/pdfs/VipMasterIC/IC/YAGO/YAGO-S-A0008145938/YAGO-S-A0008145938-1.pdf?src-supplier=IHS+Markit; ComponentLink1Description: https://datasheet.ciiva.com:443/pdfs/VipMasterIC/IC/YAGO/YAGO-S-A0008145938/YAGO-S-A0008145938-1.pdf?src-supplier=IHS+Markit; ComponentLink2URL: https://datasheet.ciiva.com/46395/443971-46395016.pdf?src-supplier=Element14; ComponentLink2Description: https://datasheet.ciiva.com/46395/443971-46395016.pdf?src-supplier=Element14; ComponentLink3URL: https://datasheet.ciiva.com/2454/pyu-r-int-thick-7-2454045.pdf?src-supplier=Digikey; ComponentLink3Description: https://datasheet.ciiva.com/2454/pyu-r-int-thick-7-2454045.pdf?src-supplier=Digikey; ComponentLink4URL: https://datasheet.ciiva.com/2454/pyu-r-int-thick-7-2454046.pdf?src-supplier=Digikey; ComponentLink4Description: https://datasheet.ciiva.com/2454/pyu-r-int-thick-7-2454046.pdf?src-supplier=Digikey; ComponentLink5URL: https://datasheet.ciiva.com/2454/pyu-r-int-thick-7-2454047.pdf?src-supplier=Digikey; ComponentLink5Description: https://datasheet.ciiva.com/2454/pyu-r-int-thick-7-2454047.pdf?src-supplier=Digikey
R16 R21 = RT0603BRE075KL: RES 5K OHM 0.1% 1/10W 0603; Manufacturer: Yageo; Supplier: Digikey; Supplier Part Number: 13-RT0603BRE075KLCT-ND; Manufacturer Part Number: RT0603BRE075KL; RoHS: Yes; Category: Chip SMD Resistors; Stock: 53182; Pricing: 1=0.17, 10=0.133, 50=0.103, 100=0.0918, 500=0.07038, 1000=0.06222 (USD); ComponentLink1URL: http://www.yageo.com/documents/recent/PYu-RT_1-to-0.01_RoHS_L_9.pdf?src-supplier=Digikey; ComponentLink1Description: http://www.yageo.com/documents/recent/PYu-RT_1-to-0.01_RoHS_L_9.pdf?src-supplier=Digikey; ComponentLink2URL: https://datasheet.octopart.com/RT0603BRE075KL-Yageo-datasheet-169971040.pdf?src-supplier=Future+Electronics; ComponentLink2Description: https://datasheet.octopart.com/RT0603BRE075KL-Yageo-datasheet-169971040.pdf?src-supplier=Future+Electronics; ComponentLink3URL: https://datasheet.octopart.com/RT0603BRE075KL-Yageo-datasheet-176402239.pdf?src-supplier=Newark; ComponentLink3Description: https://datasheet.octopart.com/RT0603BRE075KL-Yageo-datasheet-176402239.pdf?src-supplier=Newark
R17-R20 = RC0603FR-0710KL: 10 kOhms ±1% 0.1W, 1/10W Chip Resistor 0603 (1608 Metric) Moisture Resistant Thick Film; Manufacturer: Yageo; Additional Feature: LASER TRIMMABLE; Power: 100mW; Rated Temperature: 70°C; Working Voltage: 75V; Temperature Coefficient (ppm/Cel): 100; Package Height: 0.45mm; Package Length: 1.6mm; Package Width: 0.8mm; Supplier: Future Electronics; Supplier Part Number: 4023214; Manufacturer Part Number: RC0603FR-0710KL; RoHS: Yes; Category: Chip SMD Resistors; Stock: 100610000; Pricing: 5000=0.0011, 25000=0.0011, 125000=0.001, 250000=0.001, 750000=0.001 (USD); Mounting Technology: Surface Mount; Pins: 2; Package Shape: Rectangular; Terminal Finish: Nickel; Min Operating Temperature: -55°C; Max Operating Temperature: 155°C; Tolerance: 1%; JESD-609 Code: e3; Resistor Type: FIXED RESISTOR; Construction: Chip; Packaging: Tape and Reel; Technology: METAL GLAZE/THICK FILM; Termination: Wraparound; Reach SVHC Compliant: Yes; RoHS Compliant: Yes; ComponentLink1URL: https://datasheet.ciiva.com:443/pdfs/VipMasterIC/IC/YAGO/YAGO-S-A0008145938/YAGO-S-A0008145938-1.pdf?src-supplier=IHS+Markit; ComponentLink1Description: https://datasheet.ciiva.com:443/pdfs/VipMasterIC/IC/YAGO/YAGO-S-A0008145938/YAGO-S-A0008145938-1.pdf?src-supplier=IHS+Markit; ComponentLink2URL: https://datasheet.ciiva.com/22747/443971-22747519.pdf?src-supplier=Element14; ComponentLink2Description: https://datasheet.ciiva.com/22747/443971-22747519.pdf?src-supplier=Element14; ComponentLink3URL: https://datasheet.ciiva.com/46440/1868787-46440891.pdf?src-supplier=Element14; ComponentLink3Description: https://datasheet.ciiva.com/46440/1868787-46440891.pdf?src-supplier=Element14; ComponentLink4URL: https://datasheet.ciiva.com/7660/38590-7660789.pdf?src-supplier=Element14; ComponentLink4Description: https://datasheet.ciiva.com/7660/38590-7660789.pdf?src-supplier=Element14; ComponentLink5URL: https://datasheet.ciiva.com/7746/1738695-7746239.pdf?src-supplier=Element14; ComponentLink5Description: https://datasheet.ciiva.com/7746/1738695-7746239.pdf?src-supplier=Element14; ComponentLink6URL: https://datasheet.ciiva.com/7983/443971-7983596.pdf?src-supplier=Element14; ComponentLink6Description: https://datasheet.ciiva.com/7983/443971-7983596.pdf?src-supplier=Element14; ComponentLink7URL: https://datasheet.ciiva.com/15189/getdatasheetpartid-409289-15189591.pdf?src-supplier=Verical; ComponentLink7Description: https://datasheet.ciiva.com/15189/getdatasheetpartid-409289-15189591.pdf?src-supplier=Verical
R22 = RC0603JR-07200RL: RES 200 OHM 5% 1/10W 0603; MF: Yageo; SnapEDA_Link: https://www.snapeda.com/parts/RC0603JR-07200RL/Yageo/view-part/?ref=snap; Package: 1608 Yageo; MP: RC0603JR-07200RL; Check_prices: https://www.snapeda.com/parts/RC0603JR-07200RL/Yageo/view-part/?ref=eda
R23 = RC0603FR-07100KL: RES 100K OHM 1% 1/10W 0603; Manufacturer: Yageo; Additional Feature: LASER TRIMMABLE; Power: 100mW; Rated Temperature: 70°C; Working Voltage: 75V; Temperature Coefficient (ppm/Cel): 100; Package Height: 0.45mm; Package Length: 1.6mm; Package Width: 0.8mm; Supplier: Future Electronics; Supplier Part Number: 3697448; Manufacturer Part Number: RC0603FR-07100KL; RoHS: Yes; Category: Chip SMD Resistors; Stock: 23540000; Pricing: 5000=0.0011, 20000=0.0011, 75000=0.001, 150000=0.001, 375000=0.001 (USD); Mounting Technology: Surface Mount; Pins: 2; Package Shape: Rectangular; Terminal Finish: Nickel; Min Operating Temperature: -55°C; Max Operating Temperature: 155°C; Tolerance: 1%; JESD-609 Code: e3; Resistor Type: FIXED RESISTOR; Construction: Chip; Packaging: Tape and Reel; Technology: METAL GLAZE/THICK FILM; Termination: Wraparound; Reach SVHC Compliant: Yes; RoHS Compliant: Yes; ComponentLink1URL: https://datasheet.ciiva.com:443/pdfs/VipMasterIC/IC/YAGO/YAGO-S-A0008145938/YAGO-S-A0008145938-1.pdf?src-supplier=IHS+Markit; ComponentLink1Description: https://datasheet.ciiva.com:443/pdfs/VipMasterIC/IC/YAGO/YAGO-S-A0008145938/YAGO-S-A0008145938-1.pdf?src-supplier=IHS+Markit; ComponentLink2URL: https://datasheet.ciiva.com/11808/0900766b80f96399-11808107.pdf?src-supplier=Rs; ComponentLink2Description: https://datasheet.ciiva.com/11808/0900766b80f96399-11808107.pdf?src-supplier=Rs; ComponentLink3URL: https://datasheet.ciiva.com/22747/443971-22747516.pdf?src-supplier=Element14; ComponentLink3Description: https://datasheet.ciiva.com/22747/443971-22747516.pdf?src-supplier=Element14; ComponentLink4URL: https://datasheet.ciiva.com/46440/1868787-46440889.pdf?src-supplier=Element14; ComponentLink4Description: https://datasheet.ciiva.com/46440/1868787-46440889.pdf?src-supplier=Element14; ComponentLink5URL: https://datasheet.ciiva.com/7746/1738695-7746234.pdf?src-supplier=Element14; ComponentLink5Description: https://datasheet.ciiva.com/7746/1738695-7746234.pdf?src-supplier=Element14; ComponentLink6URL: https://datasheet.ciiva.com/7746/1738695-7746235.pdf?src-supplier=Element14; ComponentLink6Description: https://datasheet.ciiva.com/7746/1738695-7746235.pdf?src-supplier=Element14; ComponentLink7URL: https://datasheet.ciiva.com/7983/443971-7983593.pdf?src-supplier=Element14; ComponentLink7Description: https://datasheet.ciiva.com/7983/443971-7983593.pdf?src-supplier=Element14
SW1 SW2 = EVQ-P2402W: SWITCH TACTILE SPST-NO 0.02A 15V; Manufacturer: Panasonic; Manufacturer Series: EVQP2; Illumination Type: Non-Illuminated; Current Rating: 20mA; Throw Configuration: SPST; Switch Travel: 0.25mm; Mechanical Life: 500000Cycles; Actuator Length: 0.85mm; Switch Function: Off-Mom; Actuator Color: Natural; Operating Force: 2.4N; Contact Resistance: 100mR; Circuit Configuration: 1X1; Contact Bounce Time-Max: 10ms; Contact DC Max Rating R Load: .02A@15VDC; Number of Switches: 1; Switch Action: MOMENTARY; Switch Type: Keypad; Body Breadth: 3.5mm; Body Height: 1.65mm; Body Length or Diameter: 4.7mm; Width: 3.5mm; Size: 3.5mm; Packaging: Tape and Reel; Mount: Surface Mount; Max Voltage Rating (DC): 15V; Min Operating Temperature: -40°C; Orientation: Straight; Package Quantity: 1; Height: 2.5mm; Contact Plating: Silver; Termination: J-Bend; Max Operating Temperature: 85°C; Contact Current Rating: 20mA; Series: EVQP2; Voltage Rating (DC): 15V; Depth: 5.5mm; Max Current Rating: 20mA; Electrical Life: 500000Cycles; REACH SVHC: No SVHC; RoHS Compliant: Yes; Radiation Hardening: No; Lead Free: Lead Free; Length: 4.7mm; Supplier: Mouser; Supplier Part Number: 667-EVQ-P2402W; Manufacturer Part Number: EVQ-P2402W; RoHS: Yes; Category: Tactile Switches; Stock: 21943; Pricing: 1=0.74, 10=0.603, 50=0.603, 100=0.488, 1000=0.415, 10000=0.319 (USD); Mounting Technology: Surface Mount; Terminal Finish: Gold; JESD-609 Code: e4; Contact Current(DC)-Max: 20mA; Contact Voltage(DC)-Max: 15V; Operating Force-Max: 2.4N; Reach SVHC Compliant: Yes; ComponentLink1URL: https://datasheet.ciiva.com:443/pdfs/VipMasterIC/IC/PANA/PANAS38695/PANAS38695-1.pdf?src-supplier=IHS+Markit; ComponentLink1Description: https://datasheet.ciiva.com:443/pdfs/VipMasterIC/IC/PANA/PANAS38695/PANAS38695-1.pdf?src-supplier=IHS+Markit; ComponentLink2URL: https://datasheet.ciiva.com/25603/0900766b810ad3e5-25603951.pdf?src-supplier=Rs; ComponentLink2Description: https://datasheet.ciiva.com/25603/0900766b810ad3e5-25603951.pdf?src-supplier=Rs; ComponentLink3URL: https://datasheet.ciiva.com/2901/atk0000ce6-2901462.pdf?src-supplier=Digikey; ComponentLink3Description: https://datasheet.ciiva.com/2901/atk0000ce6-2901462.pdf?src-supplier=Digikey; ComponentLink4URL: https://datasheet.ciiva.com/2901/atk0000ce6-2901463.pdf?src-supplier=Digikey; ComponentLink4Description: https://datasheet.ciiva.com/2901/atk0000ce6-2901463.pdf?src-supplier=Digikey; ComponentLink5URL: https://datasheet.ciiva.com/2901/atk0000ce6-2901464.pdf?src-supplier=Digikey; ComponentLink5Description: https://datasheet.ciiva.com/2901/atk0000ce6-2901464.pdf?src-supplier=Digikey; ComponentLink6URL: https://datasheet.ciiva.com/8166/atv0000ce7-8166415.pdf?src-supplier=Avnet; ComponentLink6Description: https://datasheet.ciiva.com/8166/atv0000ce7-8166415.pdf?src-supplier=Avnet; ComponentLink7URL: https://datasheet.ciiva.com/30238/atv0000ce7-30238297.pdf?src-supplier=Onlinecomponents.com; ComponentLink7Description: https://datasheet.ciiva.com/30238/atv0000ce7-30238297.pdf?src-supplier=Onlinecomponents.com
U4 = AP2112K-3.3TRG1: IC REG LINEAR 3.3V 600MA SOT25; Number of Regulators: 1; Output Type: Fixed; Polarity: Positive; Min Input Voltage: 2.5V; Max Input Voltage: 6V; Accuracy: 1.5%; Quiescent Current: 55uA; Dropout Voltage: 250mV; Min Operating Temperature: -40°C; Length: 3.1mm; Output Current: 600mA; Max Operating Temperature: 85°C; Package Quantity: 1; Output Voltage: 3.3V; Width: 1.7mm; Number of Outputs: 1; Packaging: Tape and Reel; Height: 1.3mm; Lead Free: Lead Free; Max Output Current: 600mA; Case/Package: SOT-23-5; Mount: Surface Mount; Number of Pins: 5
U6 = ESDALCL6-2SC6: TVS DIODE 3VWM 17VC SOT23-6; Manufacturer: STMicroelectronics; Diode Element Material: SILICON; Package Body Material: Plastic; Polarity: Unidirectional; Min Breakdown Voltage: 6V; Clamping Voltage-Max: 17V; Diode Type: TRANS VOLTAGE SUPPRESSOR; Number of Elements: 1; Supplier: Newark; Supplier Part Number: 06X3442; Manufacturer Part Number: ESDALCL6-2SC6; RoHS: Yes; Category: TVS Diodes; Pins: 6; Package Shape: Rectangular; Terminal Finish: Tin; Min Operating Temperature: -40°C; Max Operating Temperature: 125°C; JESD-609 Code: e3; Breakdown Voltage-Nom: 6V; JESD-30 Code: R-PDSO-G6; Moisture Sensitivity Level: 1; Package Style: SMALL OUTLINEMeter; Peak Reflow Temperature (Cel): 260°C; Surface Mount: Yes; Technology: AVALANCHE; Terminal Form: Gull Wing; Terminal Position: DUAL; Reach SVHC Compliant: Yes; RoHS Compliant: Yes; ComponentLink1URL: https://datasheet.ciiva.com:443/pdfs/VipMasterIC/IC/SGST/SGSTS36157/SGSTS36157-1.pdf?src-supplier=IHS+Markit; ComponentLink1Description: https://datasheet.ciiva.com:443/pdfs/VipMasterIC/IC/SGST/SGSTS36157/SGSTS36157-1.pdf?src-supplier=IHS+Markit; ComponentLink2URL: https://datasheet.ciiva.com/29883/dm00068844-29883857.pdf?src-supplier=Avnet; ComponentLink2Description: https://datasheet.ciiva.com/29883/dm00068844-29883857.pdf?src-supplier=Avnet; ComponentLink3URL: https://datasheet.ciiva.com/41443/001184005-da-01-en-tvs-diodes-esdalcl6-2sc6-sot-23-6-stm-41443461.pdf?src-supplier=Conrad; ComponentLink3Description: https://datasheet.ciiva.com/41443/001184005-da-01-en-tvs-diodes-esdalcl6-2sc6-sot-23-6-stm-41443461.pdf?src-supplier=Conrad; ComponentLink4URL: https://datasheet.ciiva.com/6575/dm00068844-6575530.pdf?src-supplier=Digikey; ComponentLink4Description: https://datasheet.ciiva.com/6575/dm00068844-6575530.pdf?src-supplier=Digikey; ComponentLink5URL: https://datasheet.ciiva.com/6575/dm00068844-6575531.pdf?src-supplier=Digikey; ComponentLink5Description: https://datasheet.ciiva.com/6575/dm00068844-6575531.pdf?src-supplier=Digikey; ComponentLink6URL: https://datasheet.ciiva.com/6575/dm00068844-6575532.pdf?src-supplier=Digikey; ComponentLink6Description: https://datasheet.ciiva.com/6575/dm00068844-6575532.pdf?src-supplier=Digikey
U7 = STM32F401RBT6: ARMÂ® CortexÂ®-M4 STM32F4 Microcontroller IC 32-Bit Single-Core 84MHz 128KB (128K x 8) FLASH 64-LQFP (10x10); MF: STMicroelectronics; SnapEDA_Link: https://www.snapeda.com/parts/STM32F401RBT6/STMicroelectronics/view-part/?ref=snap; Package: LQFP-64 STMicroelectronics; Value: *; MP: STM32F401RBT6; Check_prices: https://www.snapeda.com/parts/STM32F401RBT6/STMicroelectronics/view-part/?ref=eda
X1 = TSX-3225 16.0000MF18X-AC0: CRYSTAL 16.0000MHZ 9PF SMD; Manufacturer: Epson; Additional Feature: TAPE AND REEL; Aging: 1 PPM/FIRST YEAR; Crystal/Resonator Type: PARALLEL - FUNDAMENTAL; Drive Level: 1uW; Frequency Stability: 0.0018%; Frequency Tolerance: 10ppm; Operating Frequency-Nom: 160; ESR: 60R; Supplier: Digikey; Supplier Part Number: SER4070CT-ND; Manufacturer Part Number: TSX-3225 16.0000MF18X-AC0; RoHS: Yes; Category: Crystals; Stock: 29085; Pricing: 1=0.39, 10=0.342, 50=0.3104, 100=0.2976, 500=0.26974 (USD); Mounting Technology: Surface Mount; Terminal Finish: Nickel; Min Operating Temperature: -40°C; Max Operating Temperature: 85°C; JESD-609 Code: e4; Load Capacitance: 9pF; Reach SVHC Compliant: Yes; RoHS Compliant: Yes; ComponentLink1URL: https://datasheet.ciiva.com:443/pdfs/VipMasterIC/IC/SEIK/SEIKS02827/SEIKS02827-1.pdf?src-supplier=IHS+Markit; ComponentLink1Description: https://datasheet.ciiva.com:443/pdfs/VipMasterIC/IC/SEIK/SEIKS02827/SEIKS02827-1.pdf?src-supplier=IHS+Markit; ComponentLink2URL: https://www.eea.epson.com/wp-content/uploads/2016/11/November-2016-PCS-MASTER-BOOK.pdf?src-supplier=Verical; ComponentLink2Description: https://www.eea.epson.com/wp-content/uploads/2016/11/November-2016-PCS-MASTER-BOOK.pdf?src-supplier=Verical; ComponentLink3URL: https://www5.epsondevice.com/en/information/support/pdf/june_2018_psc_masterbook.pdf?src-supplier=Digikey; ComponentLink3Description: https://www5.epsondevice.com/en/information/support/pdf/june_2018_psc_masterbook.pdf?src-supplier=Digikey; ComponentLink4URL: https://datasheet.octopart.com/TSX-3225-16.0000MF18X-AC0-Epson-datasheet-61114919.pdf?src-supplier=Future+Electronics; ComponentLink4Description: https://datasheet.octopart.com/TSX-3225-16.0000MF18X-AC0-Epson-datasheet-61114919.pdf?src-supplier=Future+Electronics; ComponentLink5URL: https://www.eea.epson.com/wp-content/uploads/2016/11/November-2016-PCS-MASTER-BOOK.pdf?src-supplier=Mouser; ComponentLink5Description: https://www.eea.epson.com/wp-content/uploads/2016/11/November-2016-PCS-MASTER-BOOK.pdf?src-supplier=Mouser; ComponentLink6URL: https://datasheet.octopart.com/TSX-3225-16.0000MF18X-AC0-Epson-datasheet-140567378.pdf?src-supplier=Arrow.cn; ComponentLink6Description: https://datasheet.octopart.com/TSX-3225-16.0000MF18X-AC0-Epson-datasheet-140567378.pdf?src-supplier=Arrow.cn
X2 = SC32S-7PF20PPM: CRYSTAL 32.7680KHZ 7PF SMD; Mfr_Name: Epson; Manufacturer: Seiko; Aging: 3 PPM/FIRST YEAR; Crystal/Resonator Type: PARALLEL - FUNDAMENTAL; Drive Level: 0.1uW; Frequency Tolerance: 20ppm; Operating Frequency-Nom: 0.032768; ESR: 70kR; Supplier: Digikey; Supplier Part Number: 728-1074-1-ND; Manufacturer Part Number: SC32S-7PF20PPM; RoHS: Yes; Category: Crystals; Stock: 104064; Pricing: 1=0.38, 10=0.328, 50=0.2954, 100=0.2825, 500=0.25468, 1000=0.24362 (USD); Mounting Technology: Surface Mount; Min Operating Temperature: -40°C; Max Operating Temperature: 85°C; Reach SVHC Compliant: Yes; RoHS Compliant: Yes; ComponentLink1URL: https://datasheet.ciiva.com:443/pdfs/VipMasterIC/IC/SIIS/SIISS03527/SIISS03527-1.pdf?src-supplier=IHS+Markit; ComponentLink1Description: https://datasheet.ciiva.com:443/pdfs/VipMasterIC/IC/SIIS/SIISS03527/SIISS03527-1.pdf?src-supplier=IHS+Markit; ComponentLink2URL: http://www.mouser.com/ds/2/360/file_PRODUCT_MASTER_50812_GRAPHIC03-542305.pdf?src-supplier=Mouser; ComponentLink2Description: http://www.mouser.com/ds/2/360/file_PRODUCT_MASTER_50812_GRAPHIC03-542305.pdf?src-supplier=Mouser; ComponentLink3URL: http://www.sii.co.jp/en/quartz/files/2013/03/file_PRODUCT_MASTER_50812_GRAPHIC03.pdf?src-supplier=Digikey; ComponentLink3Description: http://www.sii.co.jp/en/quartz/files/2013/03/file_PRODUCT_MASTER_50812_GRAPHIC03.pdf?src-supplier=Digikey; ComponentLink4URL: https://www.sii.co.jp/en/quartz/files/2013/03/SC-32S_Leaflet_e20151217.pdf?src-supplier=Digikey; ComponentLink4Description: https://www.sii.co.jp/en/quartz/files/2013/03/SC-32S_Leaflet_e20151217.pdf?src-supplier=Digikey